# EAGLE design schema (EAGLE 7.4.0)
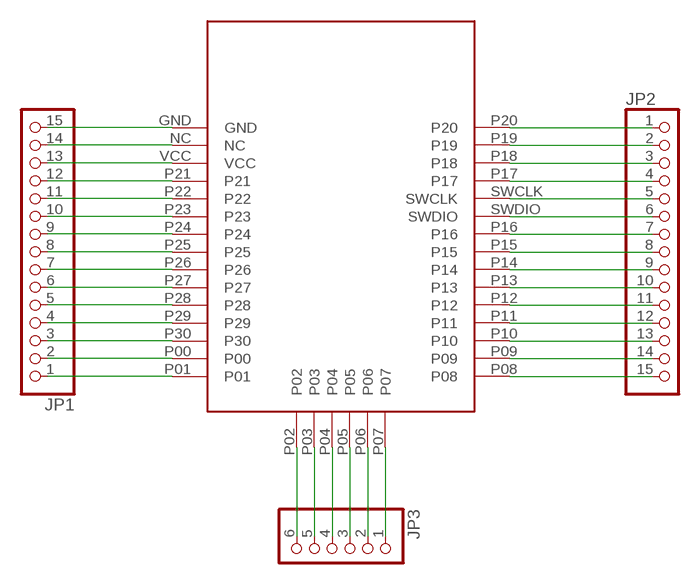
[diagram p0: schematic, sheet 1]

## Parts
JP1  PINHD-1X15  [1X15]
JP2  PINHD-1X15  [1X15]
JP3  PINHD-1X6  [1X06]
U$1  XUNTONG  [SMD]

## Nets
N$1: JP1.15 U$1.GND
N$2: JP1.14 U$1.NC
N$3: JP1.13 U$1.VCC
N$4: JP1.12 U$1.P21
N$5: JP1.11 U$1.P22
N$6: JP1.10 U$1.P23
N$7: JP1.9 U$1.P24
N$8: JP1.8 U$1.P25
N$9: JP1.7 U$1.P26
N$10: JP1.6 U$1.P27
N$11: JP1.5 U$1.P28
N$12: JP1.4 U$1.P29
N$13: JP1.3 U$1.P30
N$14: JP1.2 U$1.P00
N$15: JP1.1 U$1.P01
N$16: JP3.6 U$1.P02
N$17: JP3.5 U$1.P03
N$18: JP3.4 U$1.P04
N$19: JP3.3 U$1.P05
N$20: JP3.2 U$1.P06
N$21: JP3.1 U$1.P07
N$22: JP2.1 U$1.P20
N$23: JP2.2 U$1.P19
N$24: JP2.3 U$1.P18
N$25: JP2.4 U$1.P17
N$26: JP2.5 U$1.SWCLK
N$27: JP2.6 U$1.SWDIO
N$28: JP2.7 U$1.P16
N$29: JP2.8 U$1.P15
N$30: JP2.9 U$1.P14
N$31: JP2.10 U$1.P13
N$32: JP2.11 U$1.P12
N$33: JP2.12 U$1.P11
N$34: JP2.13 U$1.P10
N$35: JP2.14 U$1.P09
N$36: JP2.15 U$1.P08

## Library data of the parts
JP1 JP2 = pinhead:PINHD-1X15: PIN HEADER
JP3 = pinhead:PINHD-1X6: PIN HEADER
U$1 = surdu:XUNTONG

## Board
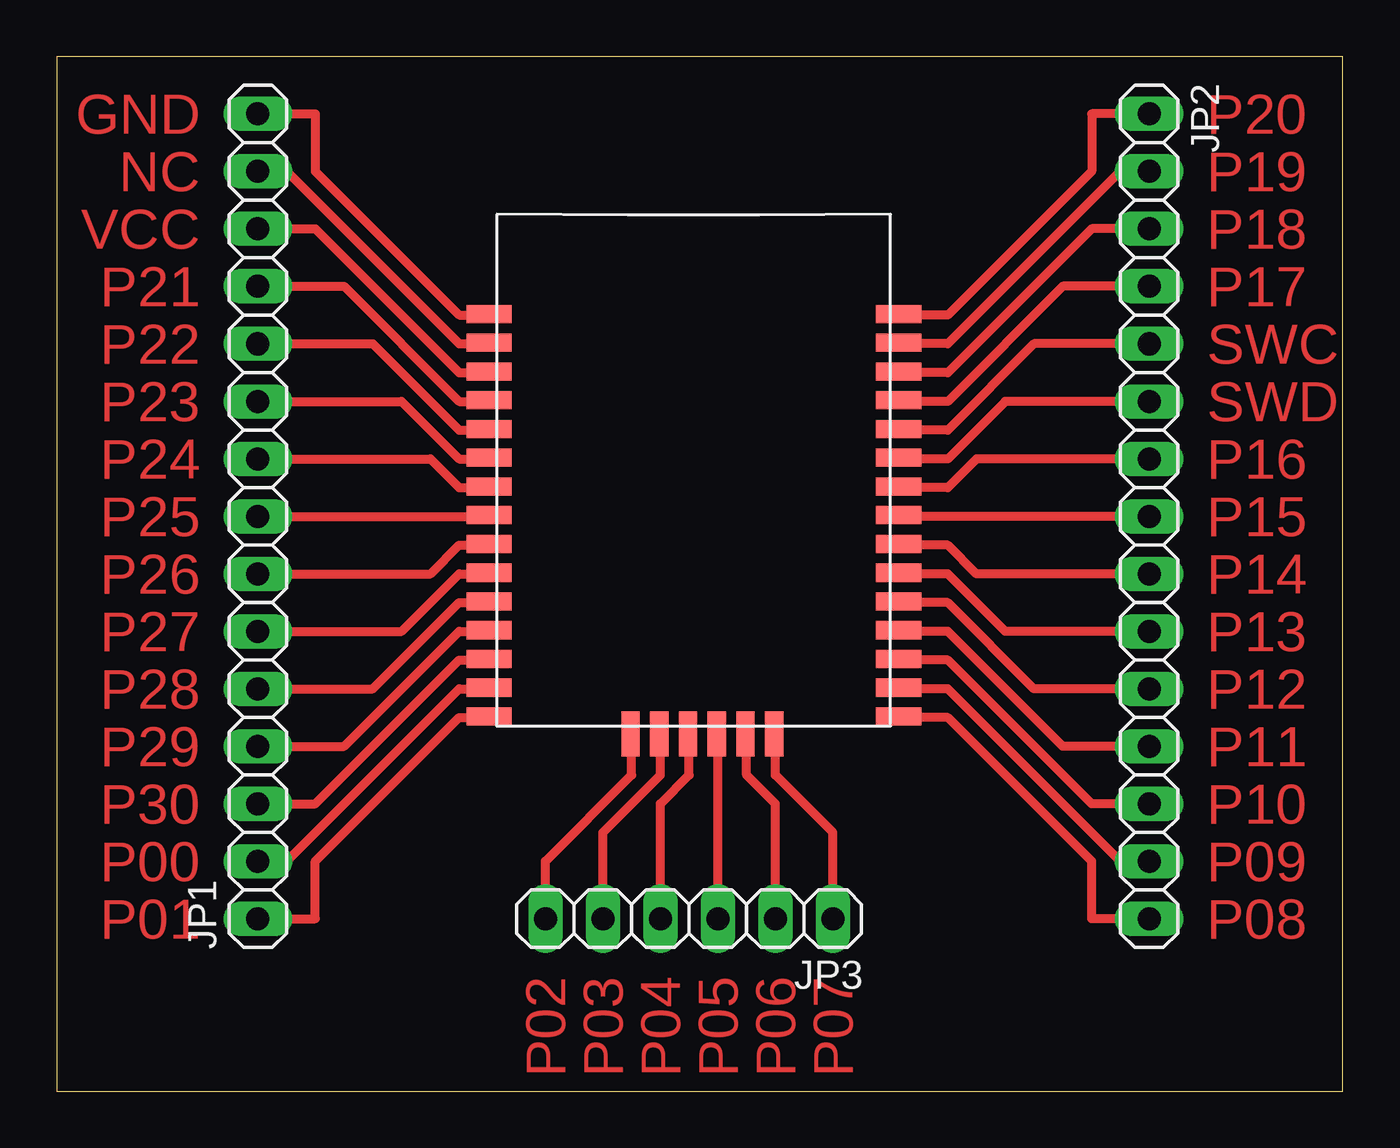
[diagram p1: board, top side]

Size 56.82 x 45.71 mm. Coordinates in mm from the lower left corner, seen from the top.
Outline: 0,0 56.82,0 56.82,45.71 0,45.71 0,0
Copper layers (1*16): Top 0.035mm / dielectric 1.5mm / Bottom 0.035mm
Design rules "default": minimum track width 10mil, minimum drill 24mil, track to track 8mil, track to pad 8mil, pad to pad 8mil, via to via 8mil, smd to smd 8mil, copper to edge 40mil, drill to drill 8mil, minimum pad ring 10mil, minimum via ring 8mil, stop-mask expansion 4mil, vias tented up to drill 0mil, thermal gap 10mil

### Footprints (pad centres in the part's own frame; a part is rotated, then mirrored left to right if it is on the bottom)
1X15 = drill 1.016 long: 1 -17.78,0; 2 -15.24,0; 3 -12.7,0; 4 -10.16,0; 5 -7.62,0; 6 -5.08,0; 7 -2.54,0; 8 0,0; 9 2.54,0; 10 5.08,0; 11 7.62,0; 12 10.16,0; 13 12.7,0; 14 15.24,0; 15 17.78,0
1X06 = drill 1.016 long: 1 -6.35,0; 2 -3.81,0; 3 -1.27,0; 4 1.27,0; 5 3.81,0; 6 6.35,0
SMD = smd 2 x 0.8: GND -8.84,6.4; NC -8.84,5.13; P00 -8.84,-10.11; P01 -8.84,-11.38; P08 9.26,-11.38; P09 9.26,-10.11; P10 9.26,-8.84; P11 9.26,-7.57; P12 9.26,-6.3; P13 9.26,-5.03; P14 9.26,-3.76; P15 9.26,-2.49; P16 9.26,-1.22; P17 9.26,2.59; P18 9.26,3.86; P19 9.26,5.13; P20 9.26,6.4; P21 -8.84,2.59; P22 -8.84,1.32; P23 -8.84,0.05; P24 -8.84,-1.22; P25 -8.84,-2.49; P26 -8.84,-3.76; P27 -8.84,-5.03; P28 -8.84,-6.3; P29 -8.84,-7.57; P30 -8.84,-8.84; SWCLK 9.26,1.32; SWDIO 9.26,0.05; VCC -8.84,3.86 | smd 0.8 x 2: P02 -2.59,-12.15; P03 -1.32,-12.15; P04 -0.05,-12.15; P05 1.22,-12.15; P06 2.49,-12.15; P07 3.76,-12.15

### Placement (x,y rotation side)
JP1  8.89,25.4 90 top
JP2  48.26,25.4 270 top
JP3  27.94,7.62 180 top
U$1  27.94,27.94 0 top

### Tracks (layer width: path | path; a pad name or v marks a point on that pad's centre or on a via)
N$1
  Top 0.406: JP1.15 11.43,43.18 11.43,40.64 17.78,34.29 19.05,34.29 U$1.GND
N$2
  Top 0.406: JP1.14 10.16,40.64 17.78,33.02 19.05,33.02 U$1.NC
N$3
  Top 0.406: JP1.13 11.43,38.1 17.78,31.75 19.05,31.75 U$1.VCC
N$4
  Top 0.406: JP1.12 12.7,35.56 17.78,30.48 19.05,30.48 U$1.P21
N$5
  Top 0.406: JP1.11 13.97,33.02 17.78,29.21 19.05,29.21 U$1.P22
N$6
  Top 0.406: JP1.10 15.24,30.48 17.78,27.94 19.05,27.94 U$1.P23
N$7
  Top 0.406: JP1.9 16.51,27.94 17.78,26.67 19.05,26.67 U$1.P24
N$8
  Top 0.406: JP1.8 19.05,25.4 U$1.P25
N$9
  Top 0.406: JP1.7 16.51,22.86 17.78,24.13 19.05,24.13 U$1.P26
N$10
  Top 0.406: JP1.6 15.24,20.32 17.78,22.86 19.05,22.86 U$1.P27
N$11
  Top 0.406: JP1.5 13.97,17.78 17.78,21.59 19.05,21.59 U$1.P28
N$12
  Top 0.406: JP1.4 12.7,15.24 17.78,20.32 19.05,20.32 U$1.P29
N$13
  Top 0.406: JP1.3 11.43,12.7 17.78,19.05 19.05,19.05 U$1.P30
N$14
  Top 0.406: JP1.2 10.16,10.16 17.78,17.78 19.05,17.78 U$1.P00
N$15
  Top 0.406: JP1.1 11.43,7.62 11.43,10.16 17.78,16.51 19.05,16.51 U$1.P01
N$16
  Top 0.406: JP3.6 21.59,10.16 25.4,13.97 25.4,15.74 U$1.P02
N$17
  Top 0.406: JP3.5 24.13,11.43 26.67,13.97 26.67,15.74 U$1.P03
N$18
  Top 0.406: JP3.4 26.67,12.7 27.94,13.97 27.94,15.74 U$1.P04
N$19
  Top 0.406: JP3.3 29.21,15.74 U$1.P05
N$20
  Top 0.406: JP3.2 31.75,12.7 30.48,13.97 30.48,15.74 U$1.P06
N$21
  Top 0.406: JP3.1 34.29,11.43 31.75,13.97 31.75,15.74 U$1.P07
N$22
  Top 0.406: JP2.1 45.72,43.18 45.72,40.64 39.37,34.29 37.25,34.29 U$1.P20
N$23
  Top 0.406: JP2.2 46.99,40.64 39.37,33.02 37.25,33.02 U$1.P19
N$24
  Top 0.406: JP2.3 45.72,38.1 39.37,31.75 37.25,31.75 U$1.P18
N$25
  Top 0.406: JP2.4 44.45,35.56 39.37,30.48 37.25,30.48 U$1.P17
N$26
  Top 0.406: JP2.5 43.18,33.02 39.37,29.21 37.25,29.21 U$1.SWCLK
N$27
  Top 0.406: JP2.6 41.91,30.48 39.37,27.94 37.25,27.94 U$1.SWDIO
N$28
  Top 0.406: JP2.7 40.64,27.94 39.37,26.67 37.25,26.67 U$1.P16
N$29
  Top 0.406: JP2.8 37.25,25.4 U$1.P15
N$30
  Top 0.406: JP2.9 40.64,22.86 39.37,24.13 37.25,24.13 U$1.P14
N$31
  Top 0.406: JP2.10 41.91,20.32 39.37,22.86 37.25,22.86 U$1.P13
N$32
  Top 0.406: JP2.11 43.18,17.78 39.37,21.59 37.25,21.59 U$1.P12
N$33
  Top 0.406: JP2.12 44.45,15.24 39.37,20.32 37.25,20.32 U$1.P11
N$34
  Top 0.406: JP2.13 45.72,12.7 39.37,19.05 37.25,19.05 U$1.P10
N$35
  Top 0.406: JP2.14 46.99,10.16 39.37,17.78 37.25,17.78 U$1.P09
N$36
  Top 0.406: JP2.15 45.72,7.62 45.72,10.16 39.37,16.51 37.25,16.51 U$1.P08

### Text on the board
Top: GND | P20 | NC | P19 | VCC | P18 | P21 | P17 | P22 | SWC | P23 | SWD | P24 | P16 | P25 | P15 | P26 | P14 | P27 | P13 | P28 | P12 | P29 | P11 | P30 | P10 | P00 | P09 | P01 | P08 | P02 | P03 | P04 | P05 | P06 | P07